# EAGLE schematic L0_C0_Resonant_Tank (EAGLE 8.4.1)
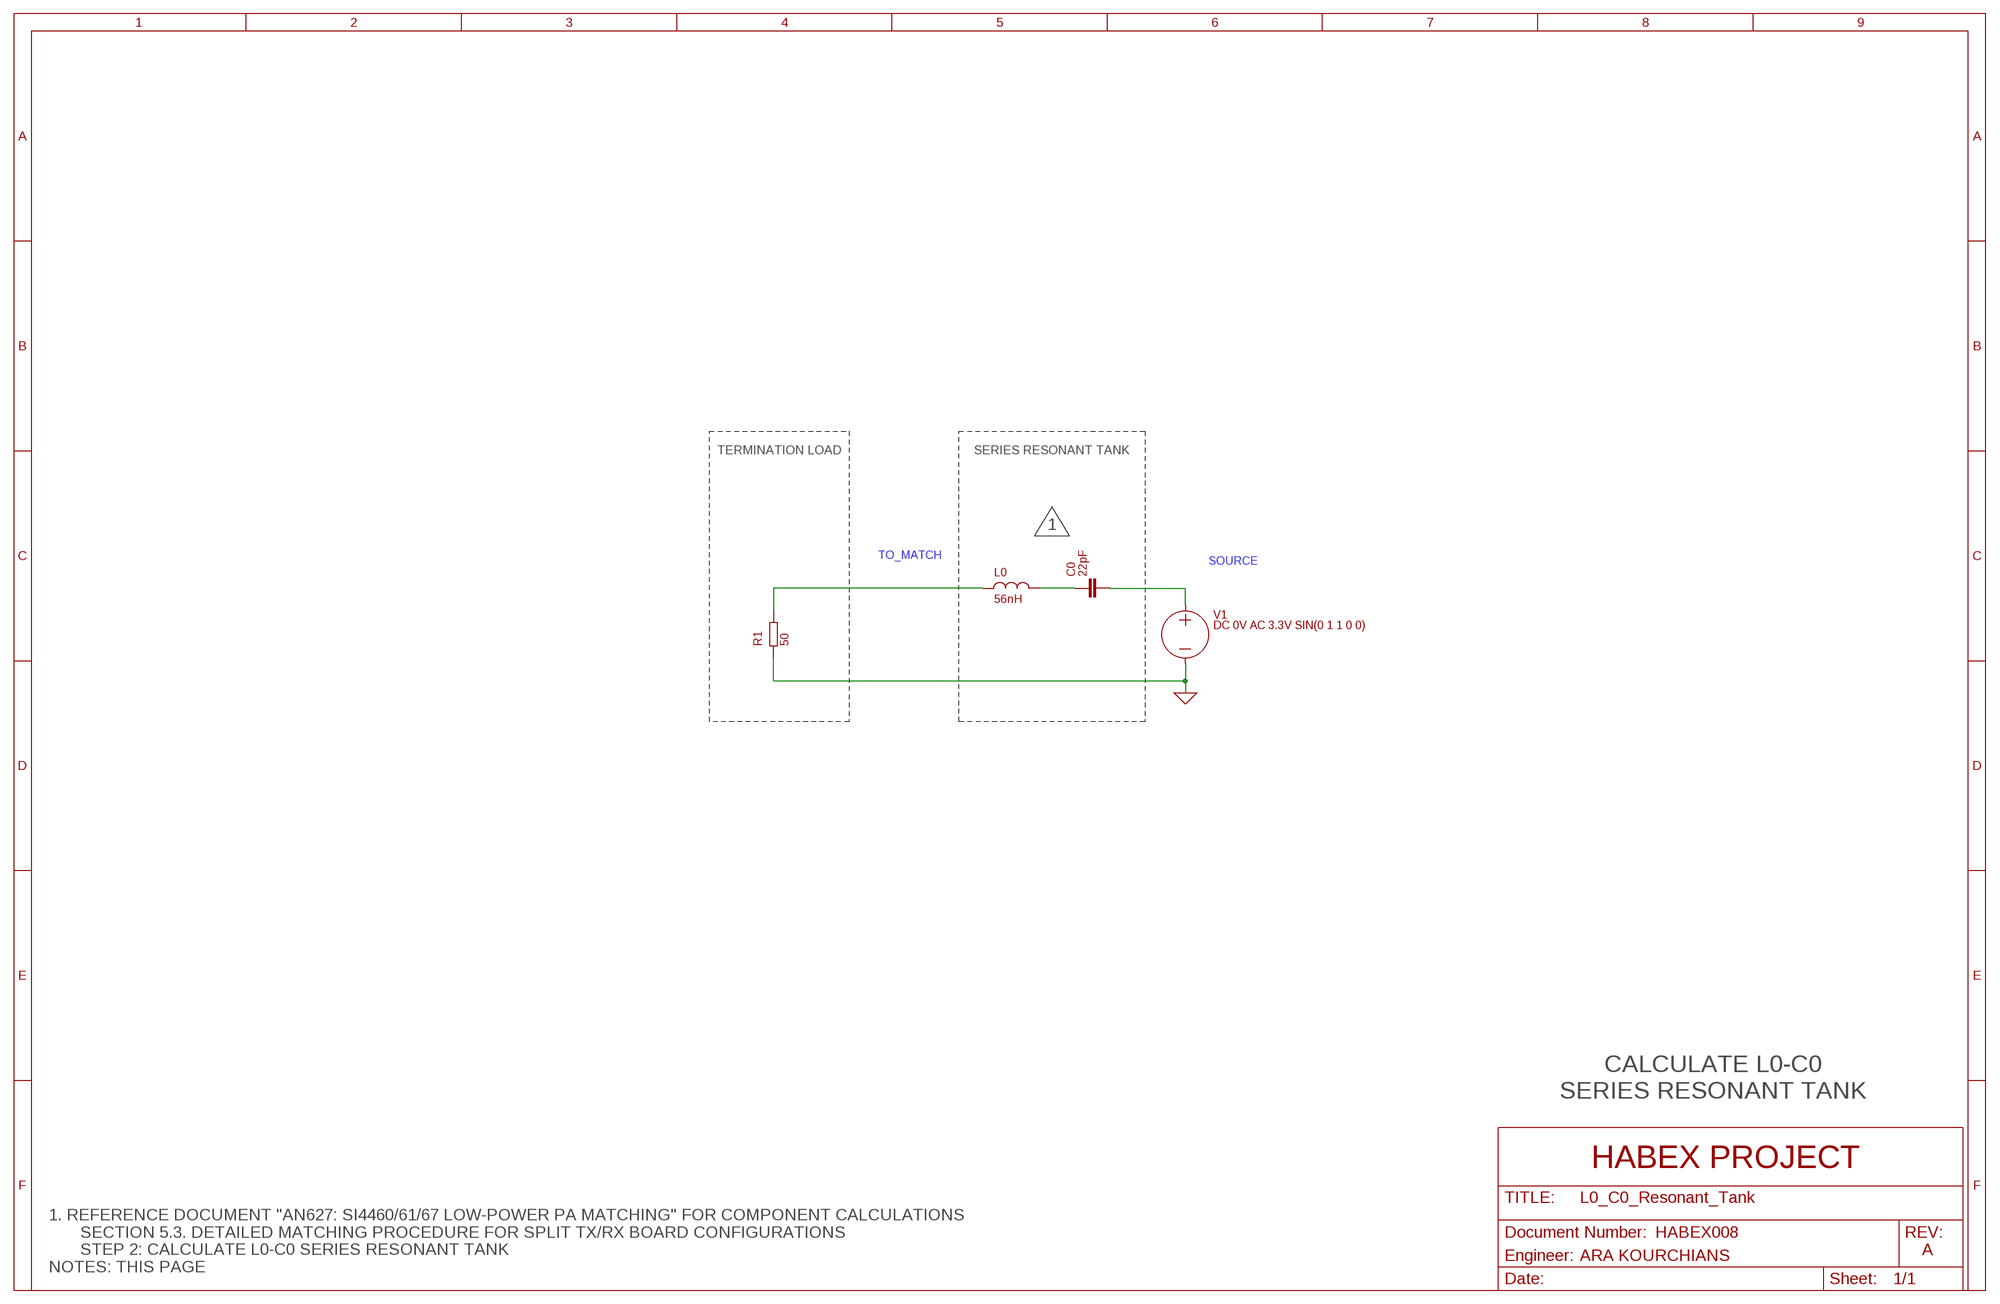
[diagram p0: schematic, sheet 1]

## Parts
C0  22pF  C  (no package)
L0  56nH  L  (no package)
R1  50  R  (no package)
V1  DC 0V AC 3.3V SIN(0 1 1 0 0)  VOLTAGE  (no package)

## Nets
0: R1.1 V1.- ; supply symbol labelled GND
N$4: C0.1 L0.2
SOURCE: C0.2 V1.+
TO_MATCH: L0.1 R1.2

## Notes on the sheet
- TERMINATION LOAD | SERIES RESONANT TANK
- 1
- CALCULATE L0-C0
  SERIES RESONANT TANK
- HABEX PROJECT
- HABEX008
- A
- Engineer: | ARA KOURCHIANS
- 1. REFERENCE DOCUMENT "AN627: SI4460/61/67 LOW-POWER PA MATCHING" FOR COMPONENT CALCULATIONS
         SECTION 5.3. DETAILED MATCHING PROCEDURE FOR SPLIT TX/RX BOARD CONFIGURATIONS
         STEP 2: CALCULATE L0-C0 SERIES RESONANT TANK
  NOTES: THIS PAGE

## Library data of the parts
C0 = ngspice-simulation:C: CAPACITOR
L0 = ngspice-simulation:L: INDUCTOR
R1 = ngspice-simulation:R: RESISTOR
V1 = ngspice-simulation:VOLTAGE: Independent Voltage Source, either DC, AC, PULSE, SINE, PWL, EXP, or SFFM; VALUE: 0V